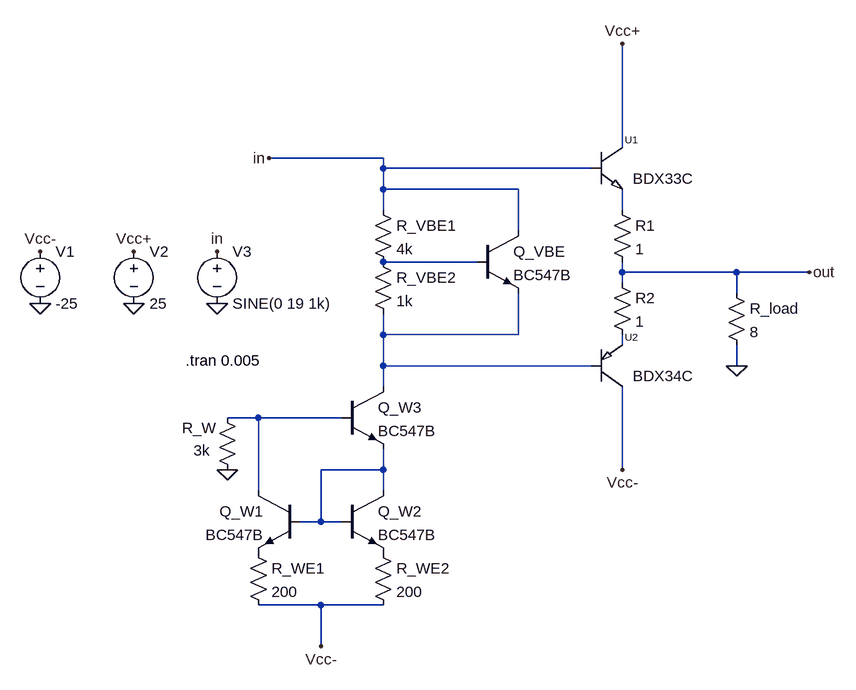
[diagram p0: schematic classABOutputStage.asc]
classABOutputStage.asc, the LTspice schematic file:
Version 4
SHEET 1 1384 680
WIRE 704 -368 704 -528
WIRE 336 -352 160 -352
WIRE 336 -336 336 -352
WIRE 656 -336 336 -336
WIRE 336 -304 336 -336
WIRE 544 -304 336 -304
WIRE 336 -272 336 -304
WIRE 704 -272 704 -304
WIRE 544 -240 544 -304
WIRE 480 -192 336 -192
WIRE 704 -176 704 -192
WIRE 880 -176 704 -176
WIRE 992 -176 880 -176
WIRE 704 -160 704 -176
WIRE 880 -144 880 -176
WIRE 336 -80 336 -112
WIRE 544 -80 544 -144
WIRE 544 -80 336 -80
WIRE 704 -64 704 -80
WIRE 336 -32 336 -80
WIRE 656 -32 336 -32
WIRE 880 -32 880 -64
WIRE 336 0 336 -32
WIRE 144 48 96 48
WIRE 272 48 144 48
WIRE 336 128 336 96
WIRE 336 128 240 128
WIRE 704 128 704 0
WIRE 144 160 144 48
WIRE 336 160 336 128
WIRE 240 208 240 128
WIRE 240 208 208 208
WIRE 272 208 240 208
WIRE 240 336 144 336
WIRE 336 336 240 336
WIRE 240 400 240 336
FLAG 96 128 0
FLAG 704 -528 Vcc+
FLAG 704 128 Vcc-
FLAG 240 400 Vcc-
FLAG -192 -128 0
FLAG -48 -128 0
FLAG -192 -208 Vcc-
FLAG -48 -208 Vcc+
FLAG 80 -128 0
FLAG 880 -32 0
FLAG 992 -176 out
FLAG 160 -352 in
FLAG 80 -208 in
SYMBOL npn 272 160 R0
SYMATTR InstName Q_W2
SYMATTR Value BC547B
SYMBOL npn 208 160 M0
SYMATTR InstName Q_W1
SYMATTR Value BC547B
SYMBOL res 128 240 R0
SYMATTR InstName R_WE1
SYMATTR Value 200
SYMBOL res 320 240 R0
SYMATTR InstName R_WE2
SYMATTR Value 200
SYMBOL npn 272 0 R0
SYMATTR InstName Q_W3
SYMATTR Value BC547B
SYMBOL res 80 32 R0
WINDOW 0 -54 32 Left 2
WINDOW 3 -36 66 Left 2
SYMATTR InstName R_W
SYMATTR Value 3k
SYMBOL res 320 -208 R0
SYMATTR InstName R_VBE2
SYMATTR Value 1k
SYMBOL res 320 -288 R0
SYMATTR InstName R_VBE1
SYMATTR Value 4k
SYMBOL npn 480 -240 R0
SYMATTR InstName Q_VBE
SYMATTR Value BC547B
SYMBOL res 864 -160 R0
SYMATTR InstName R_load
SYMATTR Value 8
SYMBOL voltage -192 -224 R0
WINDOW 123 0 0 Left 0
WINDOW 39 0 0 Left 0
SYMATTR InstName V1
SYMATTR Value -25
SYMBOL voltage -48 -224 R0
WINDOW 123 0 0 Left 0
WINDOW 39 0 0 Left 0
SYMATTR InstName V2
SYMATTR Value 25
SYMBOL voltage 80 -224 R0
WINDOW 123 0 0 Left 0
WINDOW 39 0 0 Left 0
SYMATTR InstName V3
SYMATTR Value SINE(0 19 1k)
SYMBOL bdx33c 704 -336 R0
SYMATTR InstName U1
SYMBOL bdx34c 704 -32 R0
SYMATTR InstName U2
SYMBOL res 688 -288 R0
SYMATTR InstName R1
SYMATTR Value 1
SYMBOL res 688 -176 R0
SYMATTR InstName R2
SYMATTR Value 1
TEXT 32 -40 Left 2 !.tran 0.005

The netlist it stands for:
* classABOutputStage.asc
Q_W2 N006 N006 P001 0 BC547B
Q_W1 N005 N006 P002 0 BC547B
R_WE1 P002 Vcc- 200
R_WE2 P001 Vcc- 200
Q_W3 N003 N005 N006 0 BC547B
R_W N005 0 3k
R_VBE2 N002 N003 1k
R_VBE1 in N002 4k
Q_VBE in N002 N003 0 BC547B
R_load out 0 8
V1 Vcc- 0 -25
V2 Vcc+ 0 25
V3 in 0 SINE(0 19 1k)
XU1 Vcc+ in N001 BDX33C  ; pins 1 2 3
XU2 Vcc- N003 N004 BDX34C  ; pins 1 2 3
R1 N001 out 1
R2 out N004 1
.model NPN NPN
.model PNP PNP
.lib standard.bjt
.tran 0.005
.lib bdx33c.lib
.lib bdx34c.lib
.backanno
.end